# Altium schematic sheet L6225_MotorDriver_.SchDoc
size B
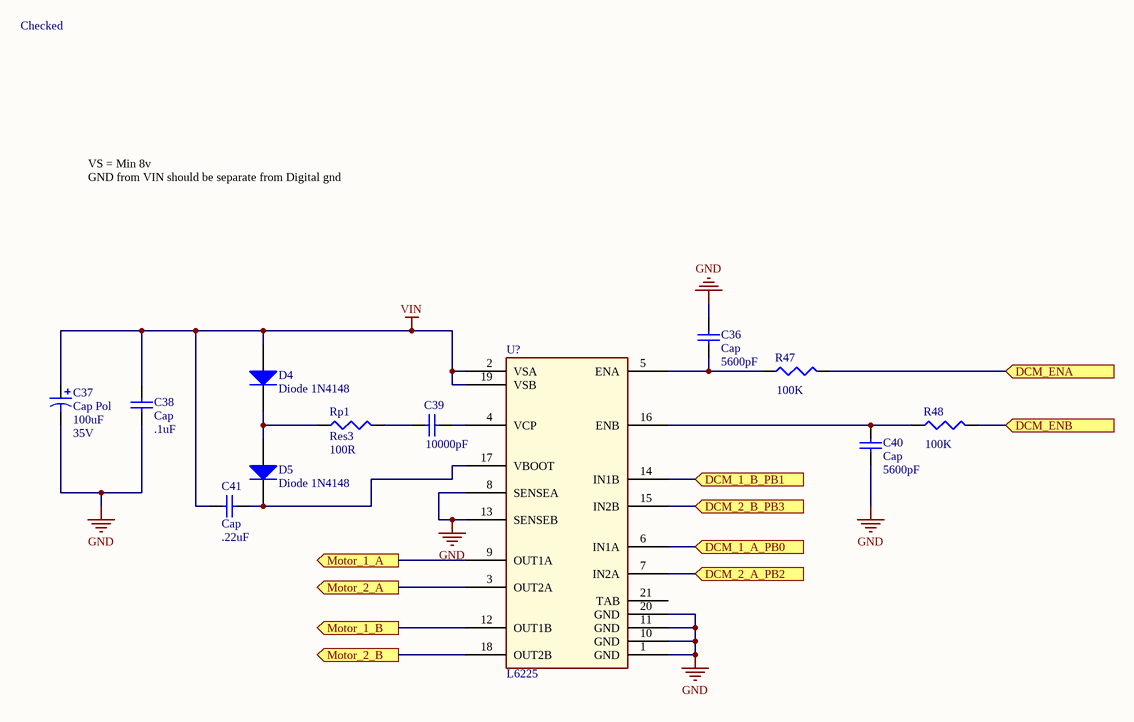
[diagram p0: L6225_MotorDriver_.SchDoc]

## Parts
C36  Cap  value 5600pF  [CAPC2012X09M]
C37  Cap Pol  value 100uF  Voltage: 35V  [CAPACITOR_6.3MM]
C38  Cap  value .1uF  [CAPC2012X09M]
C39  value 10000pF  [CAPC2012X09M]  (hidden comment: Cap)
C40  Cap  value 5600pF  [CAPC2012X09M]
C41  Cap  value .22uF  [CAPC2012X09M]
D4  Diode 1N4148  [zener_sod323]
D5  Diode 1N4148  [zener_sod323]
R47  value 100K  [RESC2112X05M]  (hidden comment: Res3)
R48  value 100K  [RESC2112X05M]  (hidden comment: Res3)
Rp1  Res3  value 100R  [RESC2112X05M]
U?  L6225  [POWERSOP20]

## Ports
DCM_1_A_PB0 (in), DCM_1_B_PB1 (in), DCM_2_A_PB2 (in), DCM_2_B_PB3 (in), DCM_ENA (in), DCM_ENB (in), Motor_1_A (out), Motor_1_B (out), Motor_2_A (out), Motor_2_B (out)

## Nets
GND: C36.2 C37.2 C38.1 C40.1 U?.1(GND) U?.8(SENSEA) U?.10(GND) U?.11(GND) U?.13(SENSEB) U?.20(GND)
VIN: C37.1 C38.2 C41.1 D4.A U?.2(VSA) U?.19(VSB)
DCM_1_A_PB0: U?.6(IN1A) ; port DCM_1_A_PB0
DCM_1_B_PB1: U?.14(IN1B) ; port DCM_1_B_PB1
DCM_2_A_PB2: U?.7(IN2A) ; port DCM_2_A_PB2
DCM_2_B_PB3: U?.15(IN2B) ; port DCM_2_B_PB3
DCM_ENA: R47.2 ; port DCM_ENA
DCM_ENB: R48.2 ; port DCM_ENB
Motor_1_A: U?.9(OUT1A) ; port Motor_1_A
Motor_1_B: U?.12(OUT1B) ; port Motor_1_B
Motor_2_A: U?.3(OUT2A) ; port Motor_2_A
Motor_2_B: U?.18(OUT2B) ; port Motor_2_B
NetC36_1: C36.1 R47.1 U?.5(ENA)
NetC39_1: C39.1 Rp1.2
NetC39_2: C39.2 U?.4(VCP)
NetC40_2: C40.2 R48.1 U?.16(ENB)
NetC41_2: C41.2 D5.K U?.17(VBOOT)
NetD4_K: D4.K D5.A Rp1.1

Not connected (* = marked no-connect by the designer): U? 21(TAB)

## Notes on the sheet
- Checked
- VS = Min 8v
  GND from VIN should be separate from Digital gnd
- ESE
- is the sole property of ESE. Any reproduction
- The Information Contained in this drawing
- Schematic P/N and Name
- Sheet Name
- 299 Doon Valley Drive
- Kitchener, ON N2G 4M4
- Canada
- Approved
- in part or in whole without the written
- permission of ESE is strictly prohibited.
- APPROVALS
- DATE
- Size
- Scale
- B
- NTS
- Bare PCB P/N
- Date
- Sheet
- Rev.
- Engineer
- of

## Library data of the parts
C36 C40 = CAP-X7R-5600pF-50V-±10%: CAP CER 5600pF 50v X7R 0805; MPN: C0805C562K5RACTU; PN: 399-1156-1-ND; Name: CAP-X7R-5600pF-50V-±10%; URL: http://www.digikey.ca/product-detail/en/C0805C562K5RACTU/399-1156-1-ND
C37 = Cap Polar-100uF-16V: CAP 85C 100uF ±20% 16V WX Series Aluminum Electrolytic; MPN: UWX1C101MCL1GB; Tan Theta: 0.16; Leakage Current: 16; Rated Ripple Current: 86; PN: 493-2105-1-ND; Name: Cap Polar-100uF-16V; Diameter: 6.3; URL: http://www.digikey.ca/product-detail/en/UWT1V101MCL1GS/493-2203-1-ND/590178
C38 = CAP-X7R-.1uF-100V-±10%: CAP CER .1uF 100v X7R 0805; MPN: C0805C104K1RACTU; PN: 399-3486-1-ND; Name: CAP-X7R-.1uF-100V-±10%; URL: http://www.digikey.ca/product-detail/en/C0805C104K1RACTU/399-3486-1-ND
C39 = CAP-X7R-10000pF-1000V-±5%: CAP CER 10000pF 1000v X7R 1210; MPN: C1210C103JDRACTU; PN: 399-5106-1-ND; Name: CAP-X7R-10000pF-1000V-±5%; URL: http://www.digikey.ca/product-detail/en/C1210C103JDRACTU/399-5106-1-ND
C41 = CAP-X7R-.22uF-50V-±10%: CAP CER .22uF 50v X7R 0805; MPN: C0805C224K5RACTU; PN: 399-3491-1-ND; Name: CAP-X7R-.22uF-50V-±10%; URL: http://www.digikey.ca/product-detail/en/C0805C224K5RACTU/399-3491-1-ND
D4 D5 = Diode 1N4148: High Conductance Fast Diode; PN: 1N4148WXTPMSCT-ND; URL: http://www.digikey.ca/product-detail/en/1N4148WX-TP/1N4148WXTPMSCT-ND/717312
R47 R48 = Resistor_100K: RES SMD 100K OHM 1% 1/8W 0805; MPN: CRCW0805100KFKEA; PN: 541-100KCCT-ND; Name: Resistor_100K; URL: http://www.digikey.ca/product-detail/en/CRCW0805100KFKEA/541-100KCCT-ND
Rp1 = Resistor_100R: RES SMD 100R OHM 1% 1/8W 0805; MPN: CRCW0805100RFKEA; PN: 541-100CCT-ND; Name: Resistor_100R; URL: http://www.digikey.ca/product-detail/en/CRCW0805100RFKEA/541-100CCT-ND
U? = L6225: IC MOTOR DRIVER PAR 20POWERSO; MPN: L6225PDTR; PN: 497-5345-1-ND; URL: http://www.digikey.ca/product-detail/en/L6225PDTR/497-5345-1-ND